# Altium schematic sheet external_connector.SchDoc
size A4; SheetNumber: 5; SheetTotal: 5
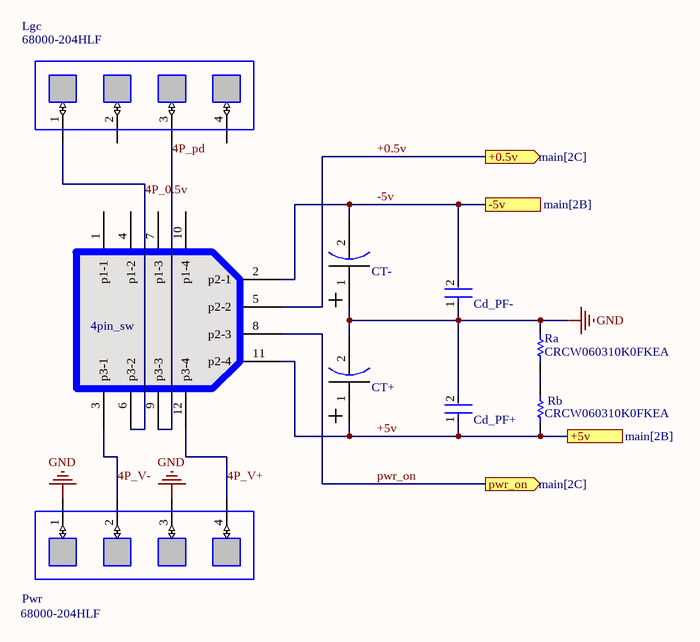
[diagram p0: external_connector.SchDoc]

## Parts
4pin_sw  1004P3T2B4M7QE  [1004P3T2B4M7QE-Footprint-1]  (value not drawn)
Cd_PF+  C0402C104K4RACTU  [FP-C0402-BB-MFG]  (value not drawn)
Cd_PF-  C0402C104K4RACTU  [FP-C0402-BB-MFG]  (value not drawn)
CT+  597D107X0040H2T  [597D107X0040H2T-Footprint-1]  (value not drawn)
CT-  597D107X0040H2T  [597D107X0040H2T-Footprint-1]  (value not drawn)
Lgc  68000-204HLF  [68000-204HLF-Footprint-1]
Pwr  68000-204HLF  [68000-204HLF-Footprint-1]
Ra  CRCW060310K0FKEA  [RESC1609X50X30NL8T20]
Rb  CRCW060310K0FKEA  [RESC1609X50X30NL8T20]

## Ports
+0.5v (out, see main[2C]), +5v (see main[2B]), -5v (see main[2B]), pwr_on (out, see main[2C])

## Nets
GND: Cd_PF+.2 Cd_PF-.1 CT+.2(neg) CT-.1(pos) Pwr.1(pin1) Pwr.3(pin1) Ra.1
4P_0.5v: 4pin_sw.6(p3-2) Lgc.1(pin1)
4P_pd: 4pin_sw.9(p3-3) Lgc.3(pin1)
4P_V+: 4pin_sw.12(p3-4) Pwr.4(pin1)
4P_V-: 4pin_sw.3(p3-1) Pwr.2(pin1)
+0.5v: 4pin_sw.5(p2-2) ; port +0.5v
+5v: 4pin_sw.11(p2-4) Cd_PF+.1 CT+.1(pos) Rb.2 ; port +5v
-5v: 4pin_sw.2(p2-1) Cd_PF-.2 CT-.2(neg) ; port -5v
pwr_on: 4pin_sw.8(p2-3) ; port pwr_on
NetRa_2: Ra.2 Rb.1

Not connected (* = marked no-connect by the designer): 4pin_sw 1(p1-1) 4(p1-2) 7(p1-3) 10(p1-4); Lgc 2(pin1) 4(pin1)

## Library data of the parts
4pin_sw = CMP-00001-7: ESWCH 1004P3T2B4M7QE Switches > Toggle > Mini Toggle Switch; Actuator Type: Standard Round; Current Rating: 5A; Electrical Life: 40000Cycles; Voltage Rating (AC): 120V; Illumination Type: Non-Illuminated; Switch Function: On-Off-On; Voltage Rating (DC): 28V; Actuator Length: 6.46mm; Actuator Material: Brass,Chrome; Throw Configuration: 4PDT; Series: 100; Mount: Through Hole,Vertical; Min Operating Temperature: -30°C; Max Operating Temperature: 85°C; Packaging: Bulk; Package Quantity: 1; RoHS Compliant: No; Termination: PC Pin
Cd_PF+ Cd_PF- = CMP-2008-02108-2: CAP CER 0.1UF 16V X7R 0402; Manufacturer: Kemet; Value: 0.10 μF; Tolerance: 0.1; Temperature Coefficient: 15%; Voltage Rating: 16 V; Package: C0402-BB; Automotive: No; Ipc Land Pattern Name: CAPC10050X50; Device Class L3: Ceramic Capacitors; Capacitance: 0.10 μF; Octopart: https://octopart.com/c0402c104k4ractu-kemet-94158; Temperature Characteristic: X7R; Mouser Description: Cap Ceramic 0.1uF 16V X7R 10% SMD 0402 125?C Paper T/R - Tape and Reel (Alt: C0402C104K4RAC TU); ComponentLink2Description: Datasheet; Temperature Range Low: -55°C; RoHS: TRUE; Device Class L1: Passive Components; Manufacturer Part Number: C0402C104K4RACTU; Material: Ceramic; Temperature Range High: +125°C; Device Class L2: Capacitors; ComponentLink2URL: https://content.kemet.com/datasheets/KEM_C1002_X7R_SMD.pdf; Category: Cap; Height: 0.55mm; Temperature: -55°C to +125°C; Lead Free: Yes; Digikey Description: CAP CER 0.1UF 16V X7R 0402
CT+ CT- = CMP-00002-5: Solid Tantalum Chip Capacitors, Ultra-Low ESR, Conformal Coated, Maximum CV; RoHS Compliant: Yes
Lgc Pwr = CMP-00000-2: Conn Unshrouded Header HDR 4 POS 2.54mm Solder ST Top Entry Thru-Hole BergStik® Bulk
Ra Rb = CMP-1666-00005-4: Chip Resistor, 10 KOhm, +/- 1%, 100 mW, -55 to 155 degC, 0603 (1608 Metric), RoHS, Tape and Reel; Manufacturer: Vishay Semiconductor; Voltage Rating: 75 V; Max Operating Temperature: 155 degC; PackageDescription: 2-Pin Surface Mount Device, Body 1.575 x 0.85 mm; ComponentLink1Description: Manufacturer URL; RoHSCompliant: true; PackageReference: 0603; REACH SVHC: Unknown; Length: 1.55 mm; DatasheetVersion: 06/2012; Packaging: Tape and Reel; Min Operating Temperature: -55 degC; Mounting Technology: Surface Mount; ComponentLink2URL: https://datasheet.ciiva.com/11809/0900766b80d98afc-11809037.pdf; Height: 0.45 mm; ComponentLink2Description: Datasheet; Package Quantity: 5000; ComponentLink1URL: http://www.vishay.com/